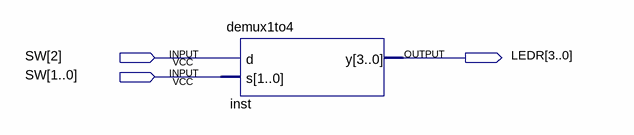
[diagram p0: schematic sheet]
// Quartus schematic block_demux1to4.bdf as structural Verilog: 1 symbols, 3 pins
module block_demux1to4 (
  input  [2:0] SW,
  output [3:0] LEDR
);

  demux1to4 inst (.d(SW[2]), .s(SW[1:0]), .y(LEDR));
endmodule
